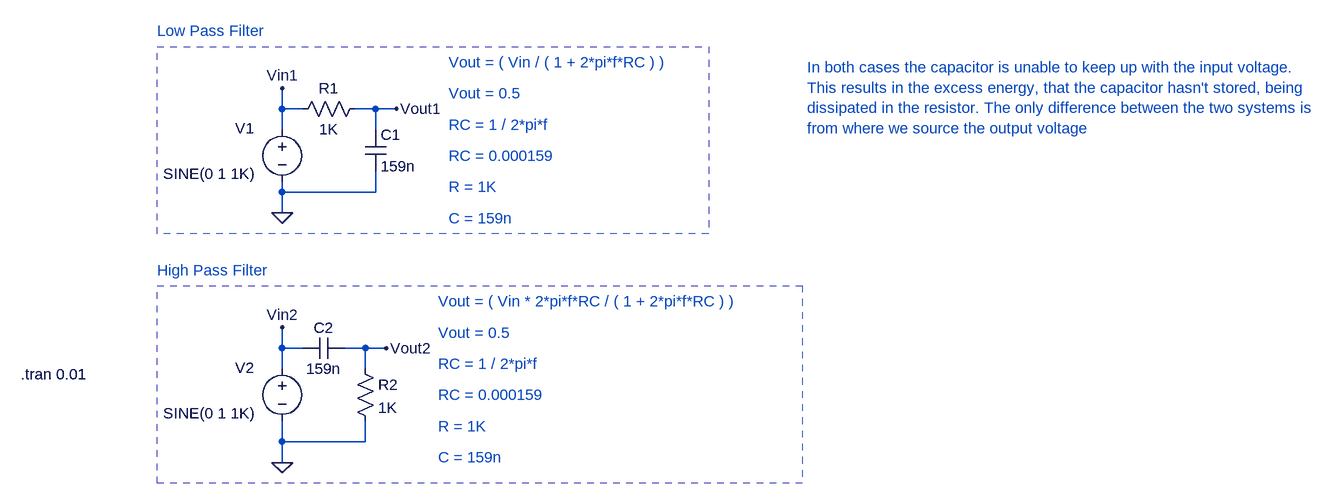
[diagram p0: schematic High and Low Pass Filters.asc]
High and Low Pass Filters.asc, the LTspice schematic file:
Version 4
SHEET 1 2080 680
WIRE 416 -16 416 -48
WIRE 448 -16 416 -16
WIRE 560 -16 528 -16
WIRE 592 -16 560 -16
WIRE 416 16 416 -16
WIRE 560 16 560 -16
WIRE 416 112 416 96
WIRE 560 112 560 80
WIRE 560 112 416 112
WIRE 416 144 416 112
WIRE 416 352 416 320
WIRE 448 352 416 352
WIRE 544 352 512 352
WIRE 576 352 544 352
WIRE 416 384 416 352
WIRE 544 384 544 352
WIRE 416 496 416 464
WIRE 544 496 544 464
WIRE 544 496 416 496
WIRE 416 528 416 496
FLAG 592 -16 Vout1
FLAG 576 352 Vout2
FLAG 416 528 0
FLAG 416 144 0
FLAG 416 320 Vin2
FLAG 416 -48 Vin1
SYMBOL voltage 416 368 R0
WINDOW 0 -72 14 Left 2
WINDOW 3 -183 84 Left 2
WINDOW 123 0 0 Left 0
WINDOW 39 0 0 Left 0
SYMATTR InstName V2
SYMATTR Value SINE(0 1 1K)
SYMBOL res 544 -32 R90
WINDOW 0 0 56 VBottom 2
WINDOW 3 32 56 VTop 2
SYMATTR InstName R1
SYMATTR Value 1K
SYMBOL cap 544 16 R0
SYMATTR InstName C1
SYMATTR Value 159n
SYMBOL cap 448 368 R270
WINDOW 0 32 32 VTop 2
WINDOW 3 0 32 VBottom 2
SYMATTR InstName C2
SYMATTR Value 159n
SYMBOL res 528 368 R0
SYMATTR InstName R2
SYMATTR Value 1K
SYMBOL voltage 416 0 R0
WINDOW 0 -72 14 Left 2
WINDOW 3 -183 84 Left 2
WINDOW 123 0 0 Left 0
WINDOW 39 0 0 Left 0
SYMATTR InstName V1
SYMATTR Value SINE(0 1 1K)
TEXT 14 392 Left 2 !.tran 0.01
TEXT 672 -88 Left 2 ;Vout = ( Vin / ( 1 + 2*pi*f*RC ) )
TEXT 672 8 Left 2 ;RC = 1 / 2*pi*f
TEXT 672 56 Left 2 ;RC = 0.000159
TEXT 672 -40 Left 2 ;Vout = 0.5
TEXT 672 104 Left 2 ;R = 1K
TEXT 672 152 Left 2 ;C = 159n
TEXT 656 280 Left 2 ;Vout = ( Vin * 2*pi*f*RC / ( 1 + 2*pi*f*RC ) )
TEXT 656 376 Left 2 ;RC = 1 / 2*pi*f
TEXT 656 424 Left 2 ;RC = 0.000159
TEXT 656 328 Left 2 ;Vout = 0.5
TEXT 656 472 Left 2 ;R = 1K
TEXT 656 520 Left 2 ;C = 159n
TEXT 224 -136 Left 2 ;Low Pass Filter
TEXT 224 232 Left 2 ;High Pass Filter
TEXT 1224 -80 Left 2 ;In both cases the capacitor is unable to keep up with the input voltage.\nThis results in the excess energy, that the capacitor hasn't stored, being\ndissipated in the resistor. The only difference between the two systems is\nfrom where we source the output voltage
RECTANGLE Normal 1072 176 224 -112 2
RECTANGLE Normal 1216 560 224 256 2

The netlist it stands for:
* High and Low Pass Filters.asc
V2 Vin2 0 SINE(0 1 1K)
R1 Vout1 Vin1 1K
C1 Vout1 0 159n
C2 Vin2 Vout2 159n
R2 Vout2 0 1K
V1 Vin1 0 SINE(0 1 1K)
.tran 0.01
* Vout = ( Vin / ( 1 + 2*pi*f*RC ) )
* RC = 1 / 2*pi*f
* RC = 0.000159
* Vout = 0.5
* R = 1K
* C = 159n
* Vout = ( Vin * 2*pi*f*RC / ( 1 + 2*pi*f*RC ) )
* RC = 1 / 2*pi*f
* RC = 0.000159
* Vout = 0.5
* R = 1K
* C = 159n
* Low Pass Filter
* High Pass Filter
* In both cases the capacitor is unable to keep up with the input voltage.
* This results in the excess energy, that the capacitor hasn't stored, being
* dissipated in the resistor. The only difference between the two systems is
* from where we source the output voltage
.backanno
.end

* Results of the author's LTspice run, read from the files saved beside the schematic
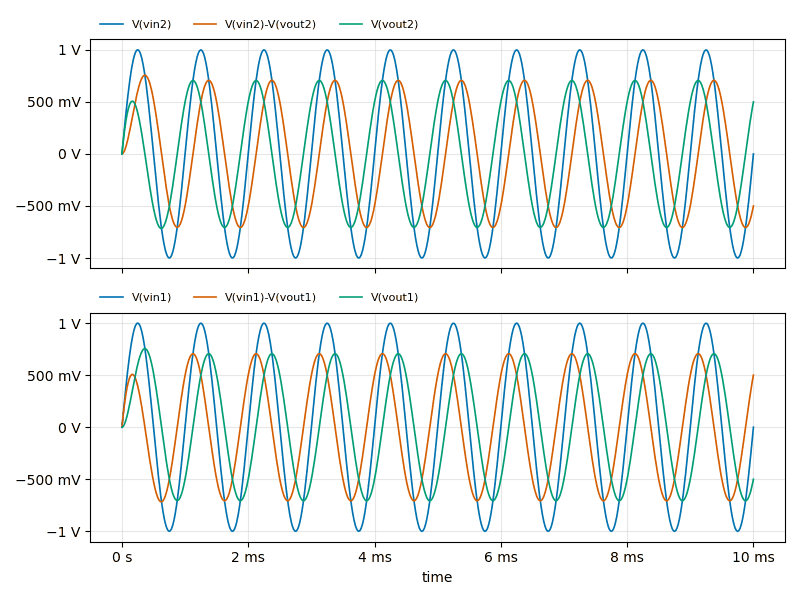
[diagram p1: Transient Analysis of High and Low Pass Filters.asc, plotted from the saved traces]
* Transient Analysis, 1 run:
*   V(vin2): min -1 V, max 1 V, average 24.13 µV, rms 707.1 mV, last 0 V
*   V(vin2)-V(vout2): min -707.3 mV, max 756.4 mV, average 7.963 mV, rms 502.1 mV, last -500 mV
*   V(vout2): min -715.8 mV, max 706.2 mV, average -7.939 mV, rms 493.4 mV, last 500 mV
*   V(vin1): min -1 V, max 1 V, average 24.13 µV, rms 707.1 mV, last 0 V
*   V(vin1)-V(vout1): min -716.5 mV, max 706.9 mV, average -7.939 mV, rms 493.8 mV, last 500 mV
*   V(vout1): min -706.7 mV, max 755.7 mV, average 7.963 mV, rms 501.7 mV, last -500 mV